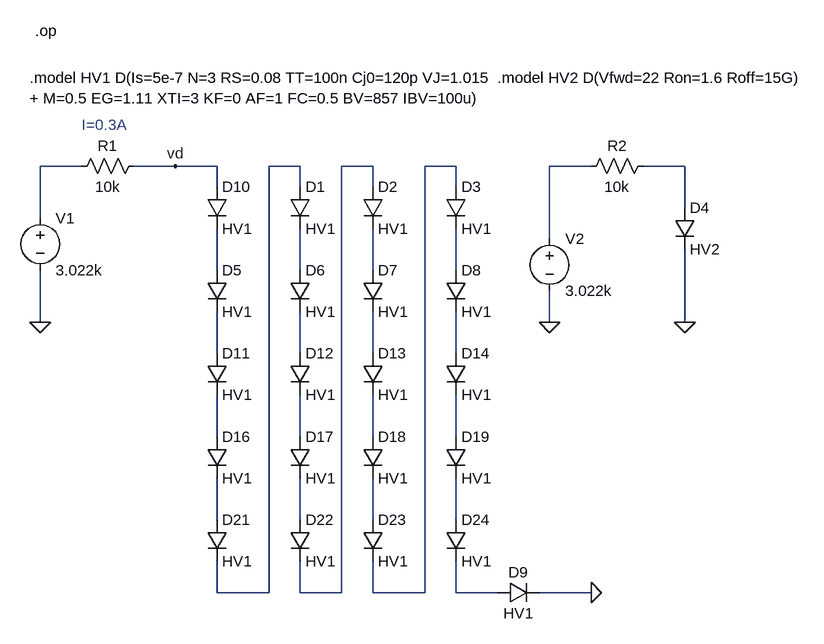
[diagram p0: schematic hv_diode.asc]
hv_diode.asc, the LTspice schematic file:
Version 4
SHEET 1 1356 708
WIRE -496 80 -496 0
WIRE -496 240 -496 160
WIRE -432 0 -496 0
WIRE -288 0 -352 0
WIRE -224 0 -288 0
WIRE -224 32 -224 0
WIRE -224 160 -224 96
WIRE -224 288 -224 224
WIRE -224 416 -224 352
WIRE -224 544 -224 480
WIRE -224 656 -224 608
WIRE -144 656 -224 656
WIRE -144 656 -144 0
WIRE -96 0 -144 0
WIRE -96 32 -96 0
WIRE -96 160 -96 96
WIRE -96 288 -96 224
WIRE -96 416 -96 352
WIRE -96 544 -96 480
WIRE -96 656 -96 608
WIRE -32 656 -96 656
WIRE -32 656 -32 0
WIRE 16 0 -32 0
WIRE 16 32 16 0
WIRE 16 160 16 96
WIRE 16 288 16 224
WIRE 16 416 16 352
WIRE 16 544 16 480
WIRE 16 656 16 608
WIRE 96 656 16 656
WIRE 96 656 96 0
WIRE 144 0 96 0
WIRE 144 32 144 0
WIRE 144 160 144 96
WIRE 144 288 144 224
WIRE 144 416 144 352
WIRE 144 544 144 480
WIRE 144 656 144 608
WIRE 208 656 144 656
WIRE 288 112 288 0
WIRE 288 240 288 192
WIRE 352 0 288 0
WIRE 352 656 272 656
WIRE 496 0 432 0
WIRE 496 64 496 0
WIRE 496 240 496 128
FLAG -496 240 0
FLAG 352 656 0
FLAG -288 0 vd
FLAG 288 240 0
FLAG 496 240 0
SYMBOL diode -240 32 R0
SYMATTR InstName D10
SYMATTR Value HV1
SYMBOL diode -112 32 R0
SYMATTR InstName D1
SYMATTR Value HV1
SYMBOL diode 0 32 R0
SYMATTR InstName D2
SYMATTR Value HV1
SYMBOL diode 128 32 R0
SYMATTR InstName D3
SYMATTR Value HV1
SYMBOL diode -240 160 R0
SYMATTR InstName D5
SYMATTR Value HV1
SYMBOL diode -112 160 R0
SYMATTR InstName D6
SYMATTR Value HV1
SYMBOL diode 0 160 R0
SYMATTR InstName D7
SYMATTR Value HV1
SYMBOL diode 128 160 R0
SYMATTR InstName D8
SYMATTR Value HV1
SYMBOL diode -240 288 R0
SYMATTR InstName D11
SYMATTR Value HV1
SYMBOL diode -112 288 R0
SYMATTR InstName D12
SYMATTR Value HV1
SYMBOL diode 0 288 R0
SYMATTR InstName D13
SYMATTR Value HV1
SYMBOL diode 128 288 R0
SYMATTR InstName D14
SYMATTR Value HV1
SYMBOL diode -240 416 R0
SYMATTR InstName D16
SYMATTR Value HV1
SYMBOL diode -112 416 R0
SYMATTR InstName D17
SYMATTR Value HV1
SYMBOL diode 0 416 R0
SYMATTR InstName D18
SYMATTR Value HV1
SYMBOL diode 128 416 R0
SYMATTR InstName D19
SYMATTR Value HV1
SYMBOL diode -240 544 R0
SYMATTR InstName D21
SYMATTR Value HV1
SYMBOL diode -112 544 R0
SYMATTR InstName D22
SYMATTR Value HV1
SYMBOL diode 0 544 R0
SYMATTR InstName D23
SYMATTR Value HV1
SYMBOL diode 128 544 R0
SYMATTR InstName D24
SYMATTR Value HV1
SYMBOL voltage -496 64 R0
WINDOW 123 0 0 Left 0
WINDOW 39 0 0 Left 0
SYMATTR InstName V1
SYMATTR Value 3.022k
SYMBOL res -448 16 R270
WINDOW 0 32 56 VTop 0
WINDOW 3 0 56 VBottom 0
SYMATTR InstName R1
SYMATTR Value 10k
SYMBOL res 336 16 R270
WINDOW 0 32 56 VTop 0
WINDOW 3 0 56 VBottom 0
SYMATTR InstName R2
SYMATTR Value 10k
SYMBOL voltage 288 96 R0
WINDOW 123 0 0 Left 0
WINDOW 39 0 0 Left 0
SYMATTR InstName V2
SYMATTR Value 3.022k
SYMBOL diode 480 64 R0
SYMATTR InstName D4
SYMATTR Value HV2
SYMBOL diode 208 672 R270
WINDOW 0 32 32 VTop 0
WINDOW 3 0 32 VBottom 0
SYMATTR InstName D9
SYMATTR Value HV1
TEXT -504 -208 Left 0 !.op
TEXT -512 -136 Left 0 !.model HV1 D(Is=5e-7 N=3 RS=0.08 TT=100n Cj0=120p VJ=1.015\n+ M=0.5 EG=1.11 XTI=3 KF=0 AF=1 FC=0.5 BV=857 IBV=100u)
TEXT 208 -136 Left 0 !.model HV2 D(Vfwd=22 Ron=1.6 Roff=15G)
TEXT -432 -64 Left 0 ;I=0.3A

The netlist it stands for:
* hv_diode.asc
D10 vd N002 HV1
D1 N006 N007 HV1
D2 N011 N012 HV1
D3 N016 N017 HV1
D5 N002 N003 HV1
D6 N007 N008 HV1
D7 N012 N013 HV1
D8 N017 N018 HV1
D11 N003 N004 HV1
D12 N008 N009 HV1
D13 N013 N014 HV1
D14 N018 N019 HV1
D16 N004 N005 HV1
D17 N009 N010 HV1
D18 N014 N015 HV1
D19 N019 N020 HV1
D21 N005 N006 HV1
D22 N010 N011 HV1
D23 N015 N016 HV1
D24 N020 N021 HV1
V1 N001 0 3.022k
R1 N001 vd 10k
R2 N022 N023 10k
V2 N022 0 3.022k
D4 N023 0 HV2
D9 N021 0 HV1
.model D D
.lib standard.dio
.op
.model HV1 D(Is=5e-7 N=3 RS=0.08 TT=100n Cj0=120p VJ=1.015
+ M=0.5 EG=1.11 XTI=3 KF=0 AF=1 FC=0.5 BV=857 IBV=100u)
.model HV2 D(Vfwd=22 Ron=1.6 Roff=15G)
* I=0.3A
.backanno
.end